# Altium schematic sheet Sensing.SchDoc: Sensing
size Tabloid; CompanyName: Vertex; Organization: Vertex Downhole Ltd.; Address1: 10911 50th Street SE; Address2: Calgary, AB; Address3: T2C 3E5; Address4: Canada; DocumentNumber: 550014; Revision: 4.1; SheetNumber: 7; SheetTotal: 8
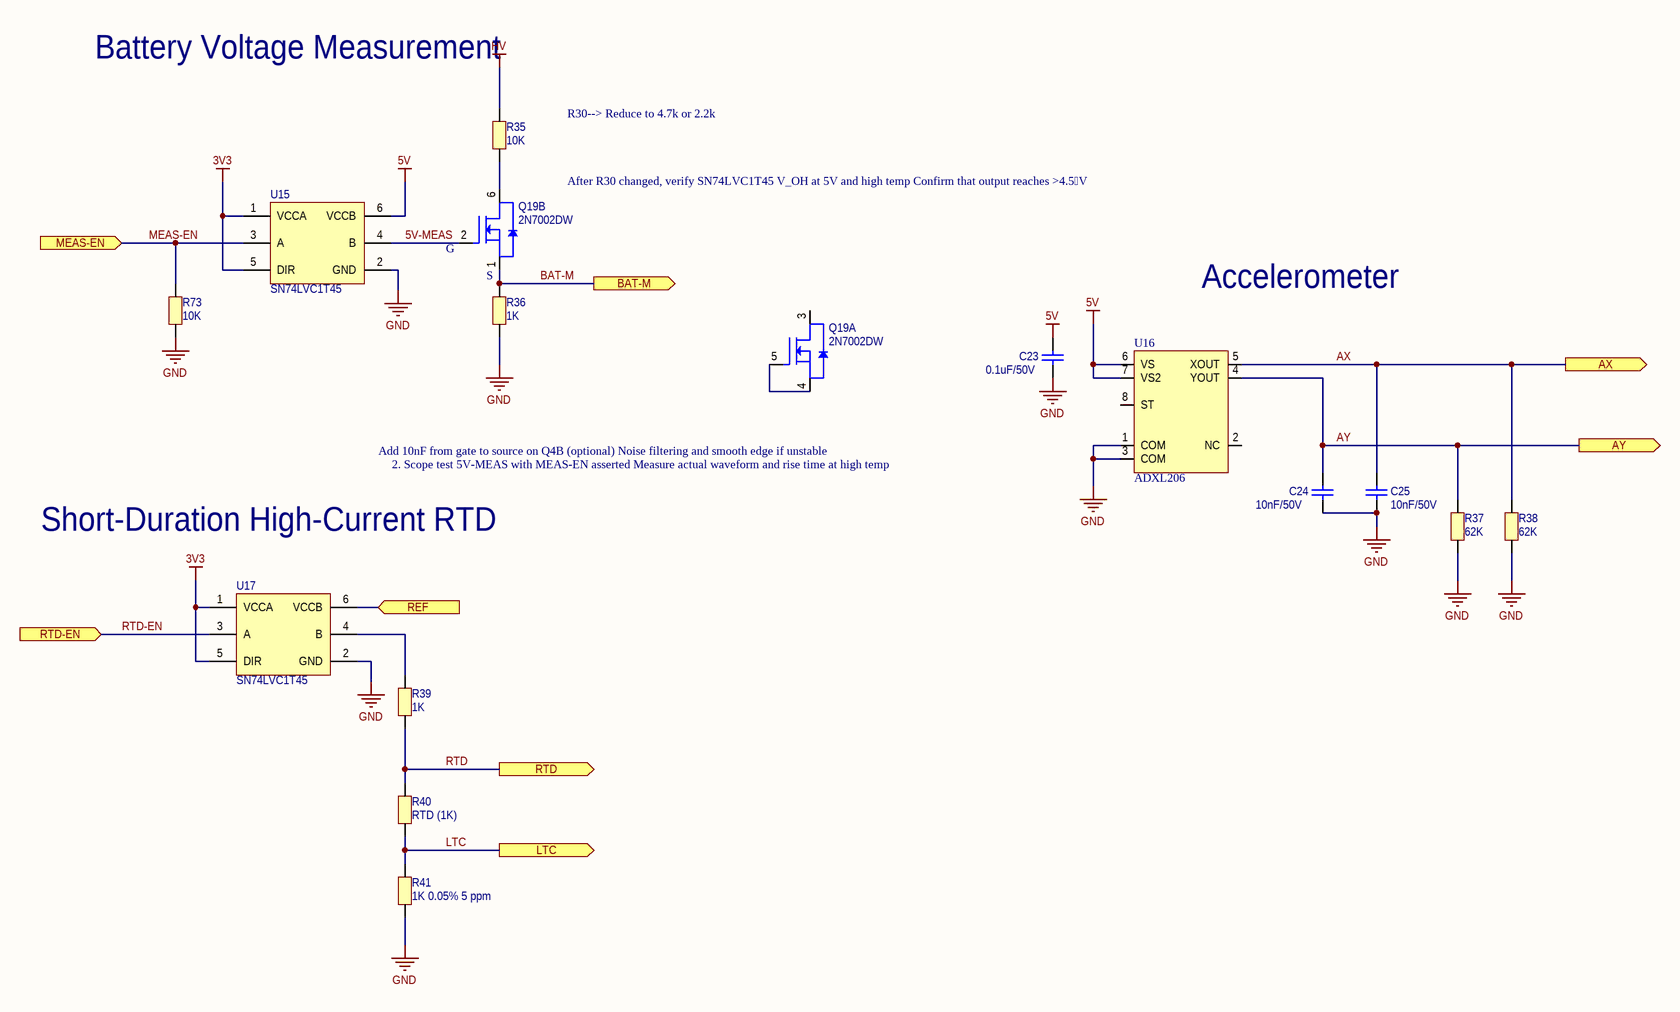
[diagram p0: Sensing.SchDoc]

## Parts
C23  0.1uF/50V  [0805-CR]
C24  10nF/50V  [0805-CR]
C25  10nF/50V  [0805-CR]
Q19  2N7002DW  [DCK-6]  (parts A,B of 2)
R35  10K  [0805-CR]
R36  1K  [0805-CR]
R37  62K  [0805-CR]
R38  62K  [0805-CR]
R39  1K  [0805-CR]
R40  RTD (1K)  [F2020]
R41  1K 0.05% 5 ppm  [0805-CR]
R73  10K  [0805-CR]
U15  SN74LVC1T45  [DBV-6]
U16  ADXL206  [D_8_1_ADI]
U17  SN74LVC1T45  [DBV-6]

## Ports
AX (out), AY (out), BAT-M (out), LTC (out), MEAS-EN (in), REF (in), RTD (out), RTD-EN (in)

## Nets
3V3: U15.1(VCCA) U15.5(DIR) U17.1(VCCA) U17.5(DIR)
5V: C23.2 U15.6(VCCB) U16.6(VS) U16.7(VS2)
GND: C23.1 C24.1 C25.1 R36.1 R37.2 R38.2 R41.2 R73.2 U15.2(GND) U16.1(COM) U16.3(COM) U17.2(GND)
HV: R35.1
5V-MEAS: Q19.2(G2) U15.4(B)
AX: C25.2 R38.1 U16.5(XOUT) ; port AX
AY: C24.2 R37.1 U16.4(YOUT) ; port AY
BAT-M: Q19.1(S2) R36.2 ; port BAT-M
LTC: R40.2 R41.1 ; port LTC
MEAS-EN: R73.1 U15.3(A) ; port MEAS-EN
REF: U17.6(VCCB) ; port REF
RTD: R39.1 R40.1 ; port RTD
RTD-EN: U17.3(A) ; port RTD-EN
NetQ19_4: Q19.4(S1) Q19.5(G1)
NetQ19_6: Q19.6(D2) R35.2
NetR39_2: R39.2 U17.4(B)

Not connected (* = marked no-connect by the designer): Q19 3(D1); U16 2(NC) 8(ST)

## Notes on the sheet
- Battery Voltage Measurement
- R30--> Reduce to 4.7k or 2.2k
- After R30 changed, verify SN74LVC1T45 V_OH at 5V and high temp Confirm that output reaches >4.5 V
- (near Q19) G
- S
- Accelerometer
- Add 10nF from gate to source on Q4B (optional) Noise filtering and smooth edge if unstable
- 2. Scope test 5V-MEAS with MEAS-EN asserted Measure actual waveform and rise time at high temp
- Short-Duration High-Current RTD
- Title
- Size:
- Date:
- Tabloid
- Number:
- Time:
- Revision:
- Sheet
- of
- File:

## Library data of the parts
C23 = Cap: Capacitor; Manufacturer: Murata Electronics North America; Vendor: Digi-Key; Vendor PN: 490-1666-1-ND; Manu PN: GRM21BR71H104KA01L; Vertex PN: 6280000
C24 C25 = Cap: Capacitor; Manufacturer: Murata Electronics North America; Vendor: Digi-Key; Vendor PN: 490-1642-1-ND; Manu PN: GRM2195C1H103JA01D; Vertex PN: 6281002
Q19 = 2N7002DW: 2N7002DW Dual N-Channel FET SC-70-6; Manufacturer: Fairchild Semiconductor; Vendor PN: 2N7002DWCT-ND; Vendor: Digi-Key; Vertex PN: 6500000; Manu PN: 2N7002DW
R35 R73 = RES: Resistor; Manufacturer: Yageo; Vendor PN: 311-10.0KCRCT-ND; Vendor: Digi-Key; Manu PN: RC0805FR-0710KL; Vertex PN: 6181002
R36 R39 = RES: Resistor; Manufacturer: Yageo; Vendor PN: 311-1.00KCRCT-ND; Vendor: Digi-Key; Manu PN: RC0805FR-071KL; Vertex PN: 6180102
R37 R38 = RES: Resistor; Manufacturer: Yageo; Vendor PN: 311-62.0KCRCT-ND; Vendor: Digi-Key; Manu PN: RC0805FR-0762KL; Vertex PN: 6186202
R40 = RES: Resistor Thermal Device; Manufacturer: TE Connectivity; Vendor PN: 223-1812-ND; Vendor: Digikey; Manu PN: NB-PTCO-164; Vertex PN: 6900005-02; Supplier 1: Digikey; Supplier Part Number 1: 223-1812-ND
R41 = RES: Resistor; Manufacturer: Vishay/Thin Film; Vendor PN: PLT0805-1.0KACT-ND; Vendor: Digi-Key; Manu PN: PLT0805Z1001AST5; Vertex PN: 6181102
U15 U17 = SN74LVC1T45: SN74LVC1T45 One Channel Level Shifter/Transceiver; Manufacturer: Texas Instruments; Vendor: Digi-Key; Vendor PN: 74LVC1T45W6-7DICT-ND; Manu PN: 74LVC1T45W6-7; Vertex PN: 6400001-01
U16 = ADXL206: ADXL206 5g High Temperature Accelerometer; Manufacturer: Analog Devices Inc.; Vendor: Digi-Key; Vendor PN: ADXL206HDZ-ND; Manu PN: ADXL206HDZ; Vertex PN: 6900007